# EAGLE design 32u4_Drill_2015_A (EAGLE 6.5.0)
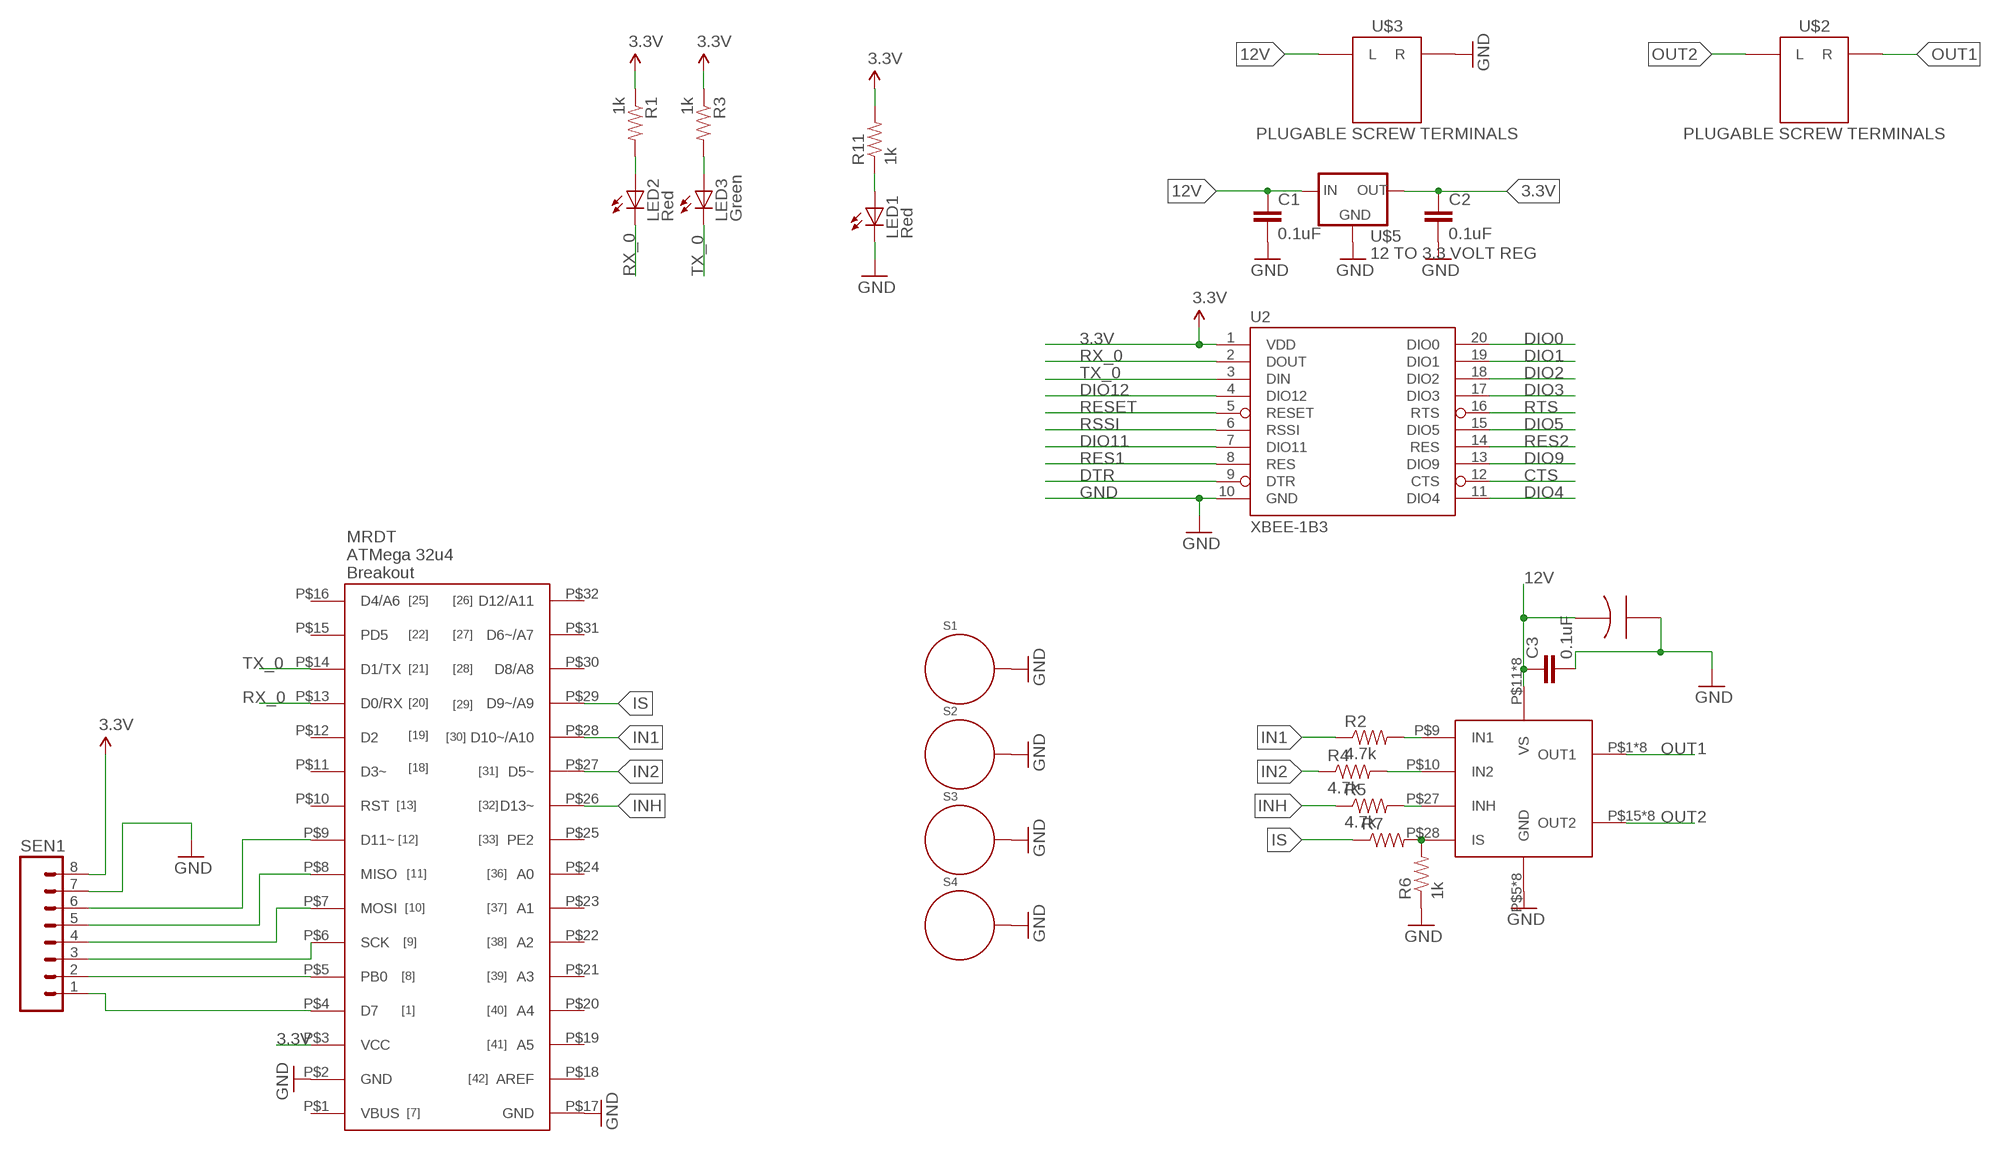
[diagram p0: schematic, sheet 1]

## Parts
C1  0.1uF  CAP1206  [1206]
C2  0.1uF  CAP1206  [1206]
C3  0.1uF  CAP1206  [1206]
LED1  Red  LED0603  [LED-0603]
LED2  Red  LED0603  [LED-0603]
LED3  Green  LED0603  [LED-0603]
R1  1k  RESISTOR1206  [1206]
R2  4.7k  RESISTOR1206  [1206]
R3  1k  RESISTOR1206  [1206]
R4  4.7k  RESISTOR1206  [1206]
R5  4.7k  RESISTOR1206  [1206]
R6  1k  RESISTOR1206  [1206]
R7  RESISTOR1206  [1206]
R11  1k  RESISTOR1206  [1206]
S1  STANDOFF_ELECTRICAL  [STANDOFF-ELECTRICAL]
S2  STANDOFF_ELECTRICAL  [STANDOFF-ELECTRICAL]
S3  STANDOFF_ELECTRICAL  [STANDOFF-ELECTRICAL]
S4  STANDOFF_ELECTRICAL  [STANDOFF-ELECTRICAL]
SEN1  M081X08  [1X08]
U2  XBEE-1B3  [XBEE-SMD]
U$1  32U4_BREAKOU_SMD  [32U3_MCU_DIP_SMD]
U$2  PLUGABLE SCREW TERMINALS  H_WR-TBL_3210002VERT  [691321100002]
U$3  PLUGABLE SCREW TERMINALS  H_WR-TBL_3210002VERT  [691321100002]
U$4  BTM7752G  [BTM7752G]
U$5  12 TO 3.3 VOLT REG  V_REG_MIC2920  [SOT223]
U$6  100UF-ELECTRO-CAP  [ELECTRO-CAP]

## Nets
3.3V [vcc]: C2.1 R1.1 R3.1 R11.2 SEN1.8 U2.1(VDD) U$1.P$3(VCC) U$5.3(OUT)
12V: C1.1 C3.1 U$3.L U$4.P$11(VS) U$4.P$12(VS) U$4.P$13(VS) U$4.P$14(VS) U$4.P$29(VS) U$4.P$30(VS) U$4.P$31(VS) U$4.P$32(VS) U$5.1(IN) U$6.POS
CTS: U2.12(CTS)
DIO0: U2.20(DIO0)
DIO1: U2.19(DIO1)
DIO2: U2.18(DIO2)
DIO3: U2.17(DIO3)
DIO4: U2.11(DIO4)
DIO5: U2.15(DIO5)
DIO9: U2.13(DIO9)
DIO11: U2.7(DIO11)
DIO12: U2.4(DIO12)
DTR: U2.9(DTR)
GND: C1.2 C2.2 C3.2 LED1.C R6.1 S1.P1 S2.P1 S3.P1 S4.P1 U2.10(GND) U$1.P$2(GND) U$1.P$17(GND) U$3.R U$4.P$5(GND) U$4.P$6(GND) U$4.P$7(GND) U$4.P$8(GND) U$4.P$23(GND) U$4.P$24(GND) U$4.P$25(GND) U$4.P$26(GND) U$5.2(GND) U$5.4(GND) U$6.NEG
IN1: R2.1 U$1.P$28(D10~/A10)
IN2: R4.1 U$1.P$27(D5~)
INH: R5.1 U$1.P$26(D13~)
IS: R7.1 U$1.P$29(D9~/A9)
N$1: LED2.A R1.2
N$2: R2.2 U$4.P$9(IN1)
N$3: R4.2 U$4.P$10(IN2)
N$4: LED3.A R3.2
N$5: R5.2 U$4.P$27(INH)
N$6: R6.2 R7.2 U$4.P$28(IS)
N$7: SEN1.1 U$1.P$4(D7)
N$8: SEN1.2 U$1.P$5(PB0)
N$9: SEN1.3 U$1.P$6(SCK)
N$10: SEN1.4 U$1.P$7(MOSI)
N$11: SEN1.5 U$1.P$8(MISO)
N$12: SEN1.6 U$1.P$9(D11~)
N$14: SEN1.7 ; supply symbol labelled GND
N$38: LED1.A R11.1
OUT1: U$2.R U$4.P$1(OUT1) U$4.P$2(OUT1) U$4.P$3(OUT1) U$4.P$4(OUT1) U$4.P$33(OUT1) U$4.P$34(OUT1) U$4.P$35(OUT1) U$4.P$36(OUT1)
OUT2: U$2.L U$4.P$15(OUT2) U$4.P$16(OUT2) U$4.P$17(OUT2) U$4.P$18(OUT2) U$4.P$19(OUT2) U$4.P$20(OUT2) U$4.P$21(OUT2) U$4.P$22(OUT2)
RES1: U2.8(RES)
RES2: U2.14(RES)
RESET: U2.5(RESET)
RSSI: U2.6(RSSI)
RTS: U2.16(RTS)
RX_0: LED2.C U2.2(DOUT) U$1.P$13(D0/RX)
TX_0: LED3.C U2.3(DIN) U$1.P$14(D1/TX)
Unconnected: U$1.P$1(VBUS) U$1.P$10(RST) U$1.P$11(D3~) U$1.P$12(D2) U$1.P$15(PD5) U$1.P$16(D4/A6) U$1.P$18(AREF) U$1.P$19(A5) U$1.P$20(A4) U$1.P$21(A3) U$1.P$22(A2) U$1.P$23(A1) U$1.P$24(A0) U$1.P$25(PE2) U$1.P$30(D8/A8) U$1.P$31(D6~/A7) U$1.P$32(D12/A11)

## Library data of the parts
C1-C3 = SparkFun-Passives:CAP: Capacitor Standard 0603 ceramic capacitor, and 0.1" leaded capacitor.
LED1-LED3 = SparkFun:LED: LEDs Standard schematic elements and footprints for 5mm, 3mm, 1206, and 0603 sized LEDs. 5mm - Spark Fun Electronics SKU : COM-00529 (and others)
R1-R7 R11 = SparkFun-Passives:RESISTOR: Resistor Basic schematic elements and footprints for 0603, 1206, and PTH resistors.
S1-S4 = SparkFun-Electromechanical:STANDOFF_ELECTRICAL: A standoff intended to be an electrically connected point. Pad size and stop size allow for a #4 Phillips pan screw head to make a solid connection to the board.
SEN1 = SparkFun-Connectors:M08: Header 8 Standard 8-pin 0.1" header. Use with straight break away headers (SKU : PRT-00116), right angle break away headers (PRT-00553), swiss pins (PRT-00743), machine pins (PRT-00117), and female headers (PRT-00115).
U2 = SparkFun:XBEE-1
U$1 = MRDT-2015-General:32U4_BREAKOU_SMD
U$2 U$3 = MRDT-2015-PowerBoard:H_WR-TBL_32*1*0002: Wurth Electronic's 2-pin 10A pluggable screw terminal headers. Vertical and Horizantal Part Numbers: 691322110002 (Horizantal) 691321100002 (Vertical); DIGIKEY_PN: 732-2763-ND
U$4 = MRDT-2015-General:BTM7752G
U$5 = SparkFun-PowerIC:V_REG_MIC2920: MIC2920A (http://www.micrel.com/_PDF/mic2920.pdf) - 400mA output LDO Regulator
U$6 = New:100UF-ELECTRO-CAP

## Net classes
1 vcc: width 0.305 mm

## Board
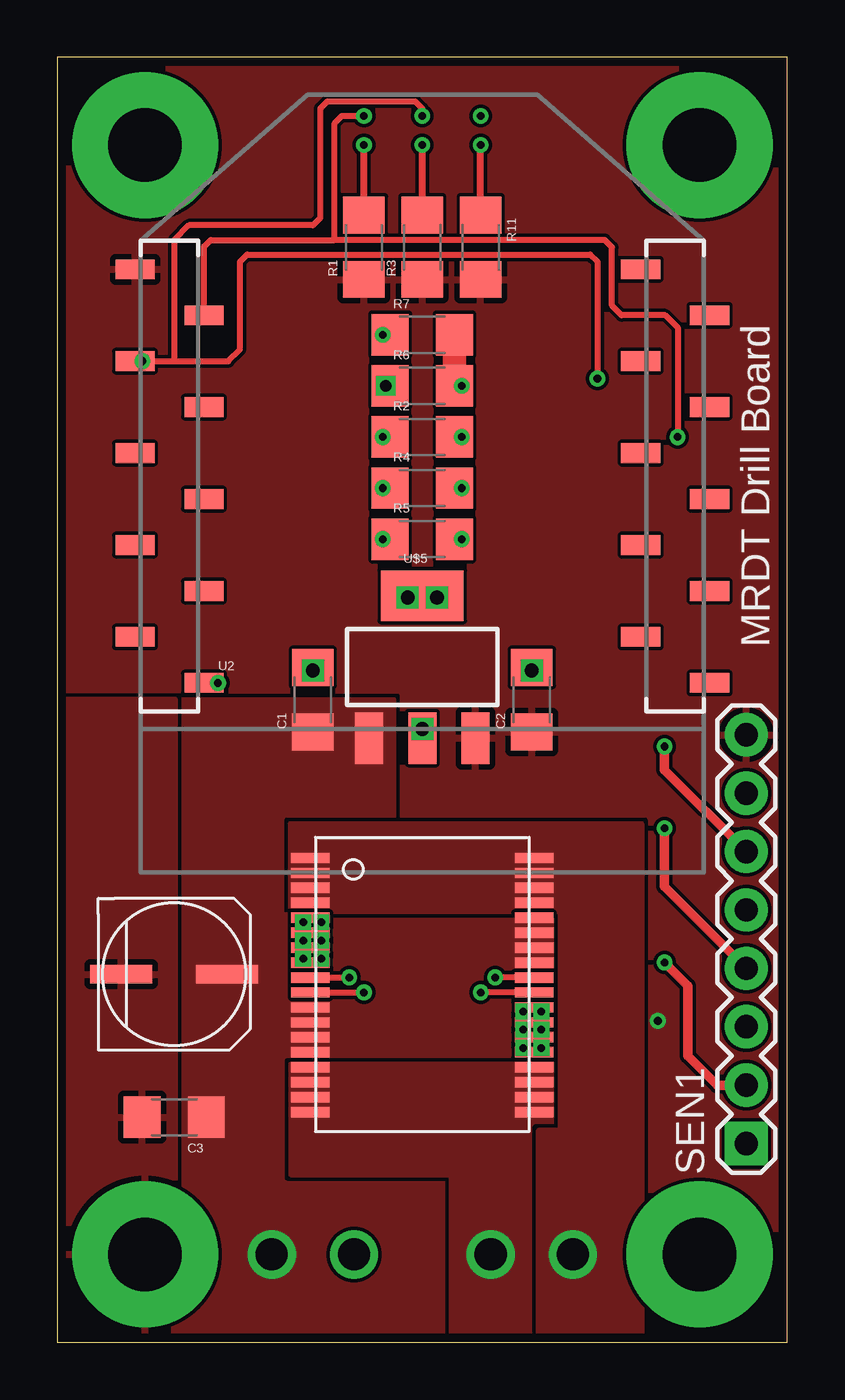
[diagram p1: board, top side]
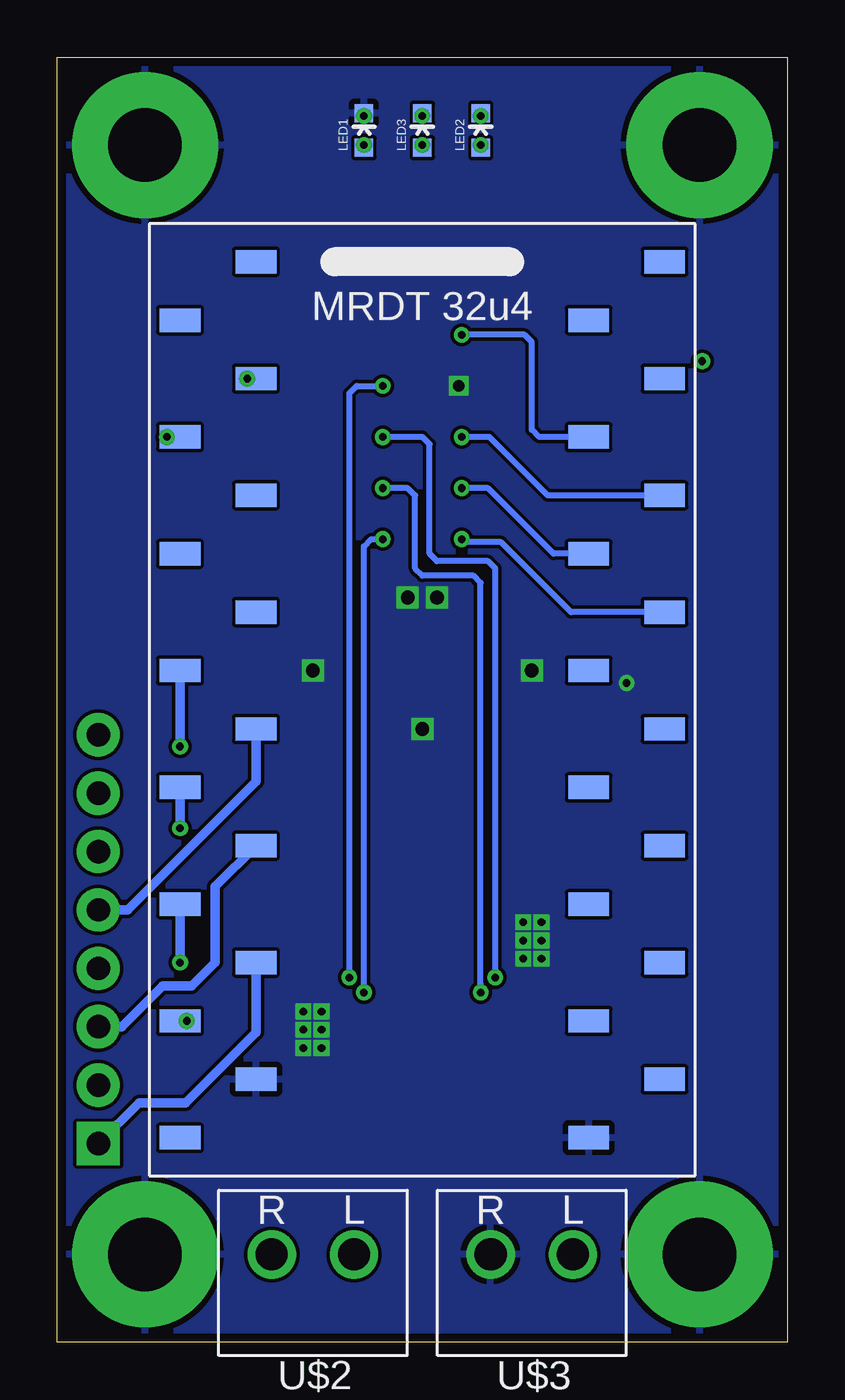
[diagram p2: board, bottom side, seen from below]

Size 31.75 x 55.88 mm. Coordinates in mm from the lower left corner, seen from the top.
Outline: 0,0 31.75,0 31.75,55.88 0,55.88 0,0
Copper layers (1*16): Top 0.0356mm / dielectric 1.5011mm / Bottom 0.0356mm
Design rules "LaenPCBOrder": minimum track width 6mil, minimum drill 13mil, track to track 6mil, track to pad 6mil, pad to pad 6mil, via to via 6mil, smd to smd 6mil, copper to edge 15mil, drill to drill 6mil, minimum pad ring 7mil, minimum via ring 7mil, stop-mask expansion 3mil, vias tented up to drill 0mil, thermal gap 10mil

### Footprints (pad centres in the part's own frame; a part is rotated, then mirrored left to right if it is on the bottom)
1206 = smd 1.6 x 1.8: 1 -1.4,0; 2 1.4,0
LED-0603 = smd 0.8 x 0.8: A 0,-0.75; C 0,0.75
STANDOFF-ELECTRICAL = drill 3.2 pad 6.35: P1 0,0
1X08 = drill 1.016 pad 1.88 square: 1 0,0 | drill 1.016 pad 1.88: 2 2.54,0; 3 5.08,0; 4 7.62,0; 5 10.16,0; 6 12.7,0; 7 15.24,0; 8 17.78,0
XBEE-SMD = smd 1.7 x 0.85: 1 -12.5,20; 2 -9.5,18; 3 -12.5,16; 4 -9.5,14; 5 -12.5,12; 6 -9.5,10; 7 -12.5,8; 8 -9.5,6; 9 -12.5,4; 10 -9.5,2; 11 12.5,2; 12 9.5,4; 13 12.5,6; 14 9.5,8; 15 12.5,10; 16 9.5,12; 17 12.5,14; 18 9.5,16; 19 12.5,18; 20 9.5,20
32U3_MCU_DIP_SMD = smd 1.778 x 1.016: P$1 -10.541,-19.05; P$2 -7.239,-16.51; P$3 -10.541,-13.97; P$4 -7.239,-11.43; P$5 -10.541,-8.89; P$6 -7.239,-6.35; P$7 -10.541,-3.81; P$8 -7.239,-1.27; P$9 -10.541,1.27; P$10 -7.239,3.81; P$11 -10.541,6.35; P$12 -7.239,8.89; P$13 -10.541,11.43; P$14 -7.239,13.97; P$15 -10.541,16.51; P$16 -7.239,19.05; P$17 7.239,-19.05; P$18 10.541,-16.51; P$19 7.239,-13.97; P$20 10.541,-11.43; P$21 7.239,-8.89; P$22 10.541,-6.35; P$23 7.239,-3.81; P$24 10.541,-1.27; P$25 7.239,1.27; P$26 10.541,3.81; P$27 7.239,6.35; P$28 10.541,8.89; P$29 7.239,11.43; P$30 10.541,13.97; P$31 7.239,16.51; P$32 10.541,19.05
691321100002 = drill 1.4: L -1.79,0; R 1.79,0
BTM7752G = smd 1.67 x 0.45: P$1 -4.865,5.5; P$2 -4.865,4.85; P$3 -4.865,4.2; P$4 -4.865,3.55; P$5 -4.865,2.9; P$6 -4.865,2.25; P$7 -4.865,1.6; P$8 -4.865,0.95; P$9 -4.865,0.3; P$10 -4.865,-0.35; P$11 -4.865,-1; P$12 -4.865,-1.65; P$13 -4.865,-2.3; P$14 -4.865,-2.95; P$15 -4.865,-3.6; P$16 -4.865,-4.25; P$17 -4.865,-4.9; P$18 -4.865,-5.55; P$19 4.865,-5.55; P$20 4.865,-4.9; P$21 4.865,-4.25; P$22 4.865,-3.6; P$23 4.865,-2.95; P$24 4.865,-2.3; P$25 4.865,-1.65; P$26 4.865,-1; P$27 4.865,-0.35; P$28 4.865,0.3; P$29 4.865,0.95; P$30 4.865,1.6; P$31 4.865,2.25; P$32 4.865,2.9; P$33 4.865,3.55; P$34 4.865,4.2; P$35 4.865,4.85; P$36 4.865,5.5
SOT223 = smd 1.219 x 2.235: 1 -2.311,-3.099; 2 0,-3.099; 3 2.311,-3.099 | smd 3.6 x 2.2: 4 0,3.099
ELECTRO-CAP = smd 2.7 x 0.8: NEG -2.3,0; POS 2.3,0

### Placement (x,y rotation side)
C1  11.11,27.94 90 top
C2  20.64,27.94 90 top
C3  5.08,9.78 180 top
LED1  18.41,52.7 0 bottom
LED2  13.34,52.7 0 bottom
LED3  15.88,52.7 0 bottom
R1  13.34,47.62 90 top
R2  15.88,39.37 0 top
R3  15.88,47.62 90 top
R4  15.88,37.15 0 top
R5  15.88,34.92 0 top
R6  15.88,41.59 0 top
R7  15.88,43.81 0 top
R11  18.41,47.62 270 top
S1  3.81,52.07 0 top
S2  27.94,52.07 0 top
S3  3.81,3.81 0 top
S4  27.94,3.81 0 top
SEN1  29.97,8.64 90 top
U2  15.88,26.67 0 top
U$1  15.88,27.94 0 bottom
U$2  20.64,3.81 180 bottom
U$3  11.11,3.81 180 bottom
U$4  15.88,15.56 0 top
U$5  15.88,29.37 0 top
U$6  5.08,16 0 top

### Tracks (layer width: path | path; a pad name or v marks a point on that pad's centre or on a via)
3.3V  (via drill 0.33)
  Bottom 0.305: v26.12,13.97 U$1.P$3
  pour Top (isolate 0.152, rank 6): -1.27,-1.27 -1.27,57.15 33.02,57.15 33.02,-1.27
12V
  pour Top (rank 5, no thermals): 5.08,0 5.08,27.94 14.61,27.94 14.61,22.54 25.4,22.54 25.4,0
GND  (via drill 0.33, 0.5, 0.6)
  Top 0.254: v21.05,14.38 21.05,14.56 U$4.P$26 | U$4.P$25 21.05,13.91 v21.05,13.59 21.05,13.26 U$4.P$24 | v21.05,12.79 21.05,12.61 U$4.P$23 | v10.69,18.26 10.69,18.46 U$4.P$5 | U$4.P$6 10.69,17.81 v10.69,17.47 10.69,17.16 U$4.P$7 | v10.69,16.67 10.69,16.51 U$4.P$8 | U$5.2 v15.88,26.67 | 14.92,32.15 15.56,32.15 U$5.4 | v14.29,41.59 R6.1
  Top 0.406: U2.10 v6.99,28.67
  Top 0.61: C1.2 v11.11,29.21 | C2.2 v20.64,29.21
  Top 1.27: v15.24,32.38 14.92,32.15
  Bottom 0.406: LED1.C v18.41,53.34
  other vias: 11.48,18.26 11.48,17.47 11.48,16.67 20.26,12.79 20.26,13.59 20.26,14.38 16.51,32.38
  pour Bottom (isolate 0.152): -3.81,-2.54 -3.81,58.42 34.29,58.42 34.29,-2.54
  pour Top: 0,0 0,27.94 5.08,27.94 5.08,0
IN1  (via drill 0.33)
  Top 0.254: 14.61,39.37 R2.1
  Top 0.406: R2.1 v14.16,39.37
  Bottom 0.254: U$1.P$28 10.41,36.83 12.95,39.37 v14.16,39.37
IN2  (via drill 0.33)
  Top 0.254: 14.92,37.15 R4.1
  Top 0.406: R4.1 v14.16,37.15
  Bottom 0.254: U$1.P$27 10.16,34.29 13.02,37.15 v14.16,37.15
INH  (via drill 0.33)
  Top 0.254: 14.61,34.92 R5.1
  Top 0.406: R5.1 v14.16,34.92
  Bottom 0.254: U$1.P$26 9.4,31.75 12.45,34.8 14.03,34.8 v14.16,34.92
IS  (via drill 0.33)
  Top 0.254: 14.92,43.81 R7.1
  Top 0.406: v14.16,43.81 R7.1
  Bottom 0.254: U$1.P$29 10.79,39.37 11.11,39.69 11.11,43.5 11.43,43.81 v14.16,43.81
N$1  (via drill 0.33)
  Top 0.305: R1.2 v13.34,52.07
  Bottom 0.305: v13.34,52.07 LED2.A
N$2  (via drill 0.33)
  Top 0.254: U$4.P$9 v12.7,15.86 | 17.78,39.37 v17.59,39.37
  Top 0.406: v17.59,39.37 R2.2
  Bottom 0.254: v17.59,39.37 15.88,39.37 15.56,39.05 15.56,34.29 15.24,33.97 13.02,33.97 12.7,33.66 12.7,16.19 12.68,15.86 v12.7,15.86
N$3  (via drill 0.33)
  Top 0.254: U$4.P$10 v13.34,15.21 | 17.78,37.15 v17.59,37.15
  Top 0.406: R4.2 v17.59,37.15
  Bottom 0.254: v17.59,37.15 16.51,37.15 16.19,36.83 16.19,33.66 15.88,33.34 13.65,33.34 13.34,33.02 13.34,15.56 13.3,15.21 v13.34,15.21
N$4  (via drill 0.33)
  Top 0.305: R3.2 v15.88,52.07
  Bottom 0.305: v15.88,52.07 LED3.A
N$5  (via drill 0.33)
  Top 0.254: U$4.P$27 v18.41,15.21 | 16.83,34.92 R5.2
  Top 0.406: R5.2 v17.59,34.92
  Bottom 0.254: v18.41,15.21 18.41,34.61 18.1,34.92 v17.59,34.92
N$6  (via drill 0.33)
  Top 0.254: U$4.P$28 v19.05,15.86 | 16.83,41.59 R6.2
  Top 0.406: R6.2 v17.59,41.59
  Top 1.016: R7.2 R6.2
  Bottom 0.254: v19.05,15.86 19.05,41.27 18.73,41.59 v17.59,41.59
N$7
  Bottom 0.406: U$1.P$4 23.11,13.46 26.16,10.41 28.19,10.41 SEN1.1
N$8  (via drill 0.33)
  Top 0.406: SEN1.2 28.7,11.18 27.43,12.45 27.43,15.49 v26.42,16.51
  Bottom 0.406: v26.42,16.51 U$1.P$5
N$9
  Bottom 0.406: SEN1.3 28.96,13.72 27.18,15.49 25.91,15.49 24.89,16.51 24.89,19.81 U$1.P$6 23.37,21.34
N$10  (via drill 0.33)
  Top 0.406: SEN1.4 26.42,19.81 v26.42,22.35
  Bottom 0.406: v26.42,22.35 U$1.P$7
N$11
  Bottom 0.406: SEN1.5 28.7,18.8 23.11,24.38 U$1.P$8
N$12  (via drill 0.33)
  Top 0.406: SEN1.6 26.42,24.89 v26.42,25.91
  Bottom 0.406: v26.42,25.91 U$1.P$9
N$38  (via drill 0.33)
  Top 0.305: R11.1 v18.41,52.07
  Bottom 0.305: v18.41,52.07 LED1.A
OUT1
  pour Top (no thermals): 10.16,18.73 10.16,22.54 25.4,22.54 25.4,0 20.95,0 20.95,9.21 21.91,9.21 21.91,18.73
OUT2
  pour Top (rank 2, no thermals): 10.16,12.06 10.16,7.3 17.14,7.3 17.14,0 20.95,0 20.95,9.21 21.91,9.21 21.91,12.06
RX_0  (via drill 0.33)
  Top 0.254: v26.99,39.37 26.99,44.13 26.45,44.67 24.55,44.67 24.13,45.09 24.13,47.62 23.81,47.94 12.06,47.94 | v13.34,53.34 12.38,53.34 12.06,53.02 12.06,47.94 | U2.2 6.38,47.65 6.67,47.94 12.06,47.94
  Bottom 0.254: v26.99,39.37 U$1.P$13 | v13.34,53.34 13.22,53.34 LED2.C
TX_0  (via drill 0.33)
  Top 0.254: v3.69,42.67 5.08,42.67 | 5.08,42.67 5.08,47.94 5.71,48.58 11.11,48.58 11.43,48.9 11.43,53.66 11.75,53.98 15.56,53.98 15.88,53.66 v15.88,53.34 | 5.08,42.67 7.43,42.67 7.94,43.18 7.94,46.99 8.26,47.31 23.18,47.31 23.5,46.99 v23.5,41.91
  Top 0.406: U2.3 v3.69,42.67
  Bottom 0.254: v23.5,41.91 23.5,41.85 U$1.P$14 22.8,42.29 | LED3.C v15.88,53.34

### Text on the board
tPlace: MRDT Drill Board